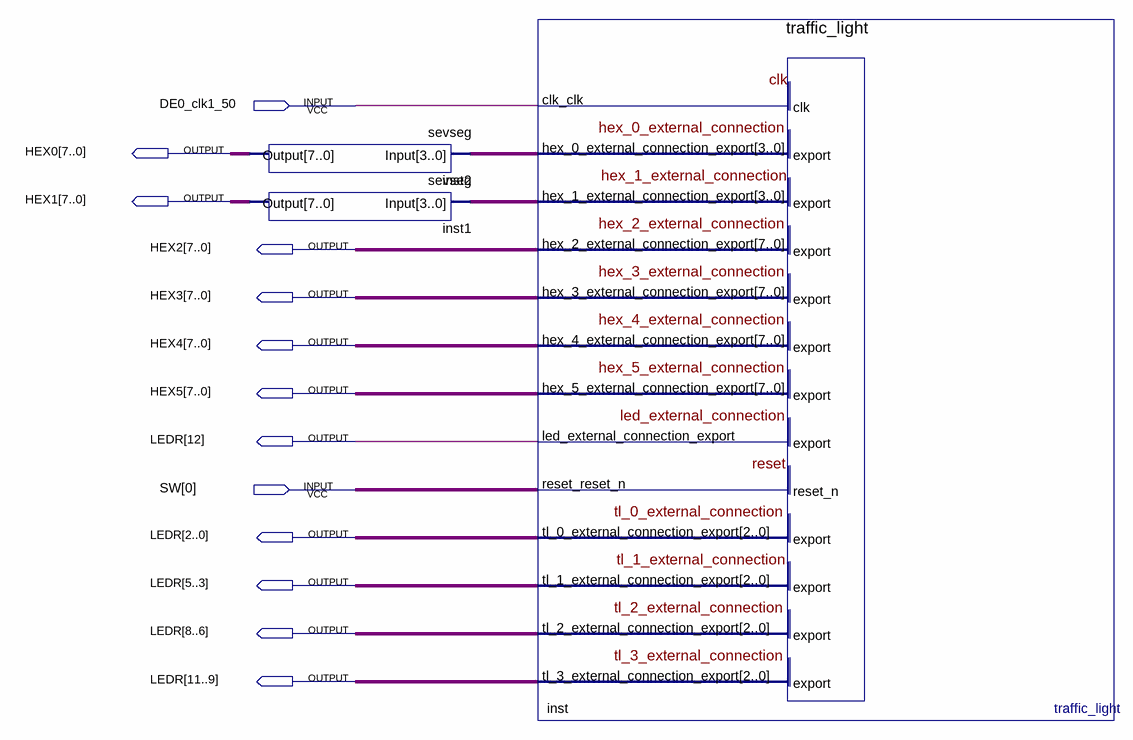
[diagram p0: schematic sheet]
// Quartus schematic toplevel.bdf as structural Verilog: 3 symbols, 13 pins
module toplevel (
  input  DE0_clk1_50,
  input  [0:0] SW,
  output [7:0] HEX0,
  output [7:0] HEX1,
  output [7:0] HEX2,
  output [7:0] HEX3,
  output [7:0] HEX4,
  output [7:0] HEX5,
  output [12:0] LEDR
);

  wire [3:0] inst_hex_0_external_connection_export, inst_hex_1_external_connection_export;

  sevseg inst2 (.Input(inst_hex_0_external_connection_export), .Output(HEX0));
  sevseg inst1 (.Input(inst_hex_1_external_connection_export), .Output(HEX1));
  traffic_light inst (
    .clk_clk(DE0_clk1_50), .reset_reset_n(SW[0]),
    .hex_0_external_connection_export(inst_hex_0_external_connection_export),
    .hex_1_external_connection_export(inst_hex_1_external_connection_export),
    .hex_2_external_connection_export(HEX2), .hex_3_external_connection_export(HEX3),
    .hex_4_external_connection_export(HEX4), .hex_5_external_connection_export(HEX5),
    .led_external_connection_export(LEDR[12]), .tl_0_external_connection_export(LEDR[2:0]),
    .tl_1_external_connection_export(LEDR[5:3]), .tl_2_external_connection_export(LEDR[8:6]),
    .tl_3_external_connection_export(LEDR[11:9]));
endmodule
